# Altium schematic sheet rf_txpa.SchDoc: mcHF QRP Transceiver RF board
size A4; Author: K Atanassov; CompanyName: M0NKA; Revision: 0.6.3; SheetTotal: 12
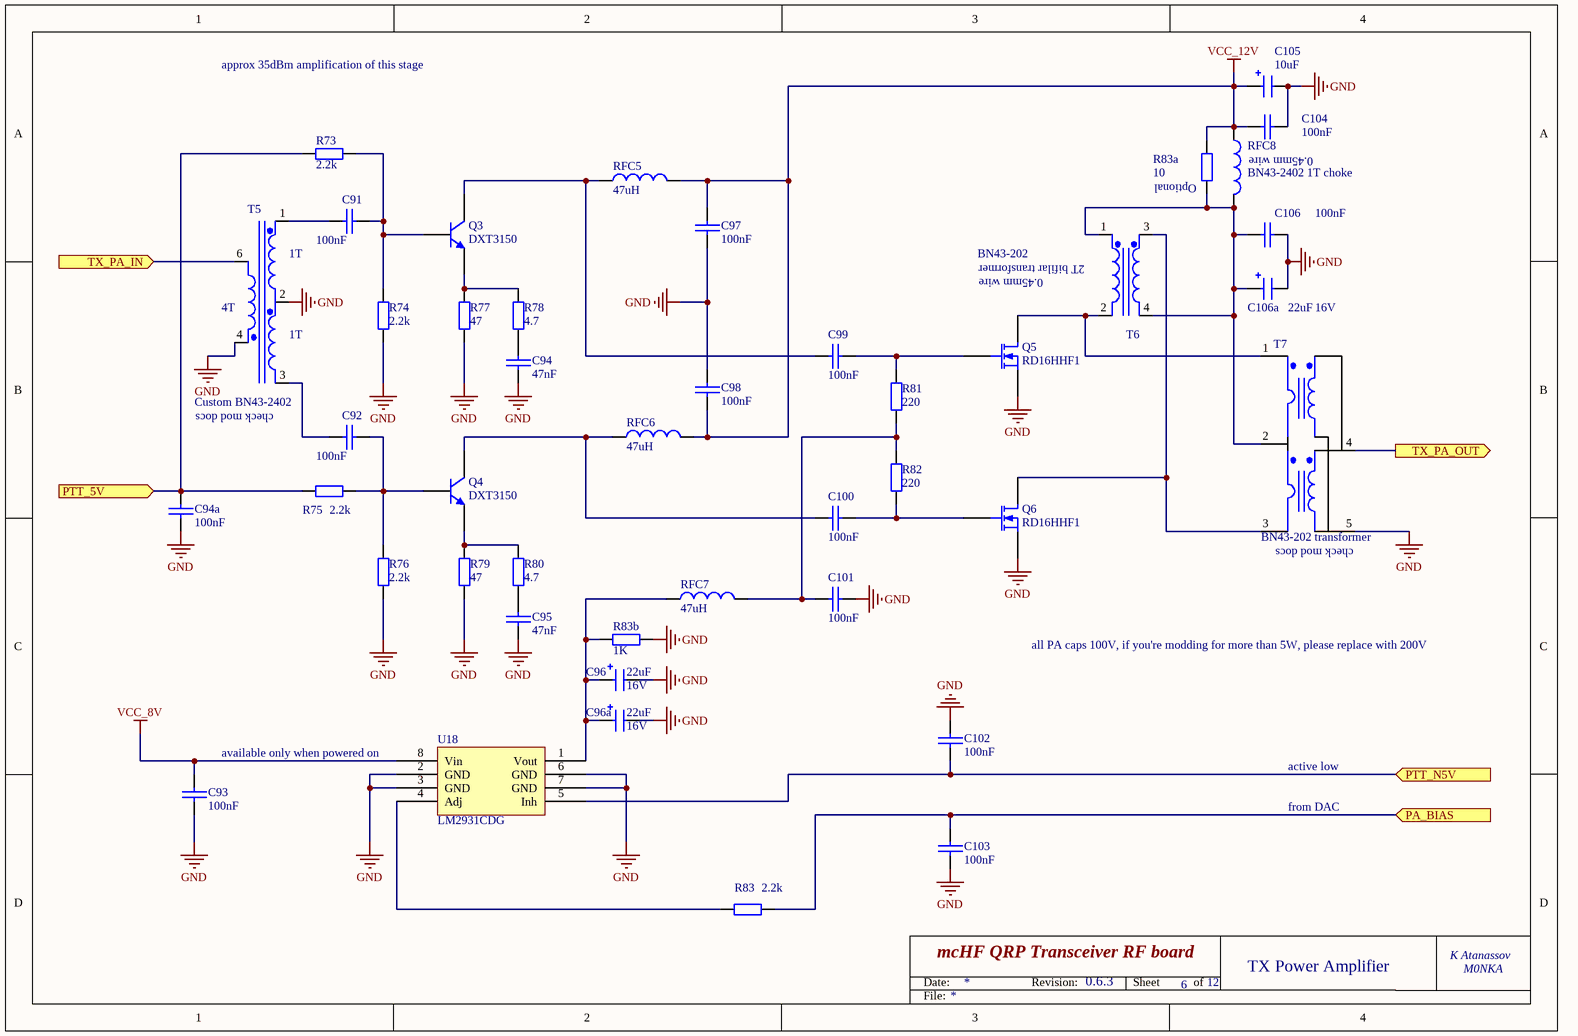
[diagram p0: rf_txpa.SchDoc]

## Parts
C91  100nF  [0805-Pro]
C92  100nF  [0805-Pro]
C93  100nF  [0805-Pro]
C94  47nF  [0805-Pro]
C94a  100nF  [0805-Pro]
C95  47nF  [0805-Pro]
C96  22uF  Voltage: 16V  [1206_Elec_Cap_N]
C96a  22uF  Voltage: 16V  [1206_Elec_Cap_N]
C97  100nF  [0805-Pro]
C98  100nF  [0805-Pro]
C99  100nF  [0805-Pro]
C100  100nF  [0805-Pro]
C101  100nF  [0805-Pro]
C102  100nF  [0805-Pro]
C103  100nF  [0805-Pro]
C104  100nF  [0805-Pro]
C105  10uF  [1206_Elec_Cap_N]
C106  100nF  [0805-Pro]
C106a  22uF  Voltage: 16V  [1206_Elec_Cap_N]
Q3  DXT3150  [SOT89L_new]
Q4  DXT3150  [SOT89L_new]
Q5  RD16HHF1  [TO-220RF_dual]
Q6  RD16HHF1  [TO-220RF_dual]
R73  2.2k  [0805-Pro]
R74  2.2k  [0805-Pro]
R75  2.2k  [0805-Pro]
R76  2.2k  [0805-Pro]
R77  47  [0805-Pro]
R78  4.7  [0805-Pro]
R79  47  [0805-Pro]
R80  4.7  [0805-Pro]
R81  220  [0805-Pro]
R82  220  [0805-Pro]
R83  2.2k  [0805-Pro]
R83a  10  [0805-Pro]
R83b  1K  [0805-Pro]
RFC5  47uH  [0805-Pro]
RFC6  47uH  [0805-Pro]
RFC7  47uH  [0805-Pro]
RFC8  BN43-2402 1T choke  [F_Bead]
T5  Custom BN43-2402  [SOP5_NEW1thr]
T6  BN43-202  [PA_TRM_b1]
T7  BN43-202 transformer  [PA_TRM_4m]
U18  LM2931CDG  [SO-8-Pro]

## Ports
PA_BIAS (in), PTT_5V (in), PTT_N5V (in), TX_PA_IN (in), TX_PA_OUT (out)

## Nets
GND: C93.2 C94.2 C94a.2 C95.2 C96.2 C96a.2 C97.2 C98.1 C101.1 C102.1 C103.2 C104.1 C105.2 C106.1 C106a.2 Q5.2(S) Q6.2(S) R74.2 R76.2 R77.1 R79.1 R83b.1 T5.2(SecCmn) T5.4(Pri-) T7.5(Sec-) U18.2(GND) U18.3(GND) U18.6(GND) U18.7(GND)
VCC_8V: C93.1 U18.8(Vin)
VCC_12V: C97.1 C98.2 C104.2 C105.1 R83a.2 RFC5.2 RFC6.2 RFC8.1
PA_BIAS: C103.1 R83.2 ; port PA_BIAS
PTT_5V: C94a.1 R73.2 R75.1 ; port PTT_5V
PTT_N5V: C102.2 U18.5(Inh) ; port PTT_N5V
TX_PA_IN: T5.6(Pri+) ; port TX_PA_IN
TX_PA_OUT: T7.4(Sec+) ; port TX_PA_OUT
NetC91_1: C91.1 Q3.1(B) R73.1 R74.1
NetC91_2: C91.2 T5.1(Sec0)
NetC92_1: C92.1 Q4.1(B) R75.2 R76.1
NetC92_2: C92.2 T5.3(Sec180)
NetC94_1: C94.1 R78.1
NetC95_1: C95.1 R80.1
NetC96_1: C96.1 C96a.1 R83b.2 RFC7.1 U18.1(Vout)
NetC99_1: C99.1 Q5.1(G) R81.2
NetC99_2: C99.2 Q3.2(C) RFC5.1
NetC100_1: C100.1 Q6.1(G) R82.1
NetC100_2: C100.2 Q4.2(C) RFC6.1
NetC101_2: C101.2 R81.1 R82.2 RFC7.2
NetC106_2: C106.2 C106a.1 R83a.1 RFC8.2 T6.1(Pri+) T6.4(Sec-) T7.2(Pri_Common)
NetQ3_3: Q3.3(E) R77.2 R78.2
NetQ4_3: Q4.3(E) R79.2 R80.2
NetQ5_3: Q5.3(D) T6.2(Pri-) T7.1(Pri_0_deg)
NetQ6_3: Q6.3(D) T6.3(Sec+) T7.3(Pri_180_deg)
NetR83_1: R83.1 U18.4(Adj)

## Notes on the sheet
- approx 35dBm amplification of this stage
- (near R83a) Optional
- (near RFC8) 0.45mm wire
- (near T5) 4T
- (near T5) 1T
- (near T6) 2T bifilar transformer
- 0.45mm wire
- (near T5) check mod docs
- (near T7) check mod docs
- all PA caps 100V, if you're modding for more than 5W, please replace with 200V
- available only when powered on
- active low
- from DAC
- 9
- TX Power Amplifier
- Date:
- Revision:
- Sheet
- of
- File:

## Library data of the parts
C91-C93 C94a C97-C104 C106 = CAP: Capacitor; Order: FN 252-2090; Voltage: 100V; QT Order: QCC-00154; Price: 0.068
C94 C95 = CAP: Capacitor; Order: FN 152-0303; QT Order: QCC-00101; Price: 0.03
C96 C96a C106a = CAP-POL: Electrolitic capacitor; Order: FN 197-294; QT Order: QCC-00202; Price: 0.235
C105 = CAP-POL: Electrolitic capacitor; Order: FN 233-3009; QT Order: QCC-00166; Price: 0.204
Q3 Q4 = DXT3150: BIPOLAR, TRANSISTOR, NPN, SOT-89; Order: FN 171-3880; Price: 0.221
Q5 Q6 = RD16HHF1: Silicon RF Power MOS FET; Order: EB 121171160336; Price: 7.375
R73-R76 R83 = RES: Resistor; Order: FN 188-7289; QT Order: QCR-00333; Price: 0.046
R77 R79 = RES: Resistor; Order: FN 173-8942; QT Order: QCR-00293; Price: 0.052
R78 R80 = RES: Resistor; Order: FN 205-7665; QT Order: QCR-00274; Price: 0.018
R81 R82 = RES: Resistor; Order: FN 933-2804; QT Order: QCR-00309; Price: 0.007
R83a = RES: Resistor; Order: FN 933-2421; QT Order: QCR-00279; Price: 0.013
R83b = RES: Resistor; Order: FN 157-6459; QT Order: QCR-00326; Price: 0.061
RFC5-RFC7 = TDK-NLV25T: INDUCTOR, SIGNAL LINE, 4.7UH, 1005; Order: FN 166-9895; Price: 0.166
RFC8 = FER_BEAD: Order: EB 300988432524; Price: 0.298
T5 = CX2074NL: Transformer 4:1; Order: EB 300988432524; Price: 0.298
T6 = PA_TR_b: BN43-202 bifilar transformer; Order: EB 291023830340; Price: 0.534
T7 = PA_TR_4m: BN43-202 2:3 transformer; Order: EB 291023830340; Price: 0.534
U18 = LM2931CDG: 100 mA, Adjustable Output,  LDO Voltage Regulator with  60 V Load Dump Protection; Order: FN 121-1100; Price: 0.39